# Altium project DIO_MCX_Isolated.PrjPCB (part 2 of 3)

## Sheet LVDS_IFC_MCX.SchDoc: DIO MCX 16 Isolated
size A3; EDA_Number: ARTIQ; Projet: ARTIQ/SINARA; Author: G.Kasprowicz; CompanyName: WUT ISE; DrawnBy: G.Kasprowicz; Organization: WUT ISE; Address1: PW ISE; Address2: Nowowiejska 15/19 00-665 Warsaw; Address3: gkasprow@gmail.com; DocumentNumber: 5; Revision: 2; SheetNumber: 5; SheetTotal: 7; ModifiedBy: -; CheckedDate: -; Title2: LVDS Interface; DivGrp: WUT ISE; Designer: G.Kasprowicz; ModifiedDate: -; ProjectName: Sensor Box
Used 2 times, as channels U_LVDS_IFCA, U_LVDS_IFCB. Parts and nets are listed once, with the designators drawn on the sheet.
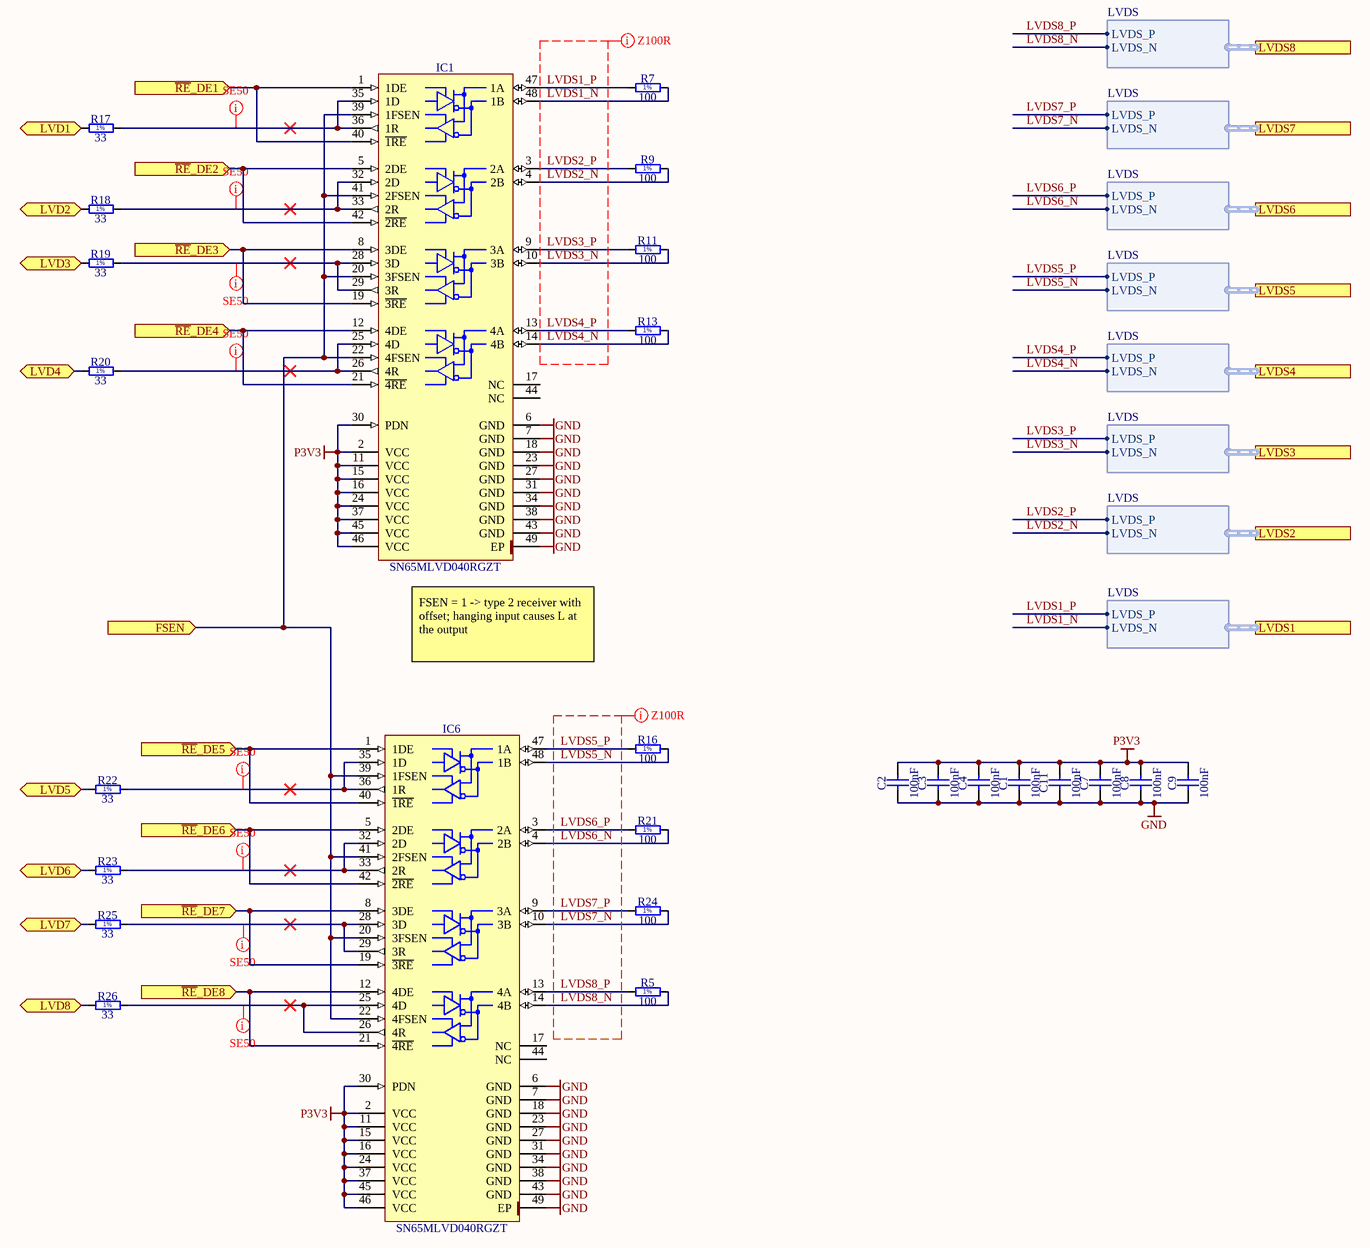
[diagram p2: LVDS_IFC_MCX.SchDoc]

### Parts
C1  100nF  [CAPC1005X55N]
C2  100nF  [CAPC1005X55N]
C3  100nF  [CAPC1005X55N]
C4  100nF  [CAPC1005X55N]
C7  100nF  [CAPC1005X55N]
C8  100nF  [CAPC1005X55N]
C9  100nF  [CAPC1005X55N]
C11  100nF  [CAPC1005X55N]
IC1  SN65MLVD040RGZT  [QFN50P700X700X100-49N-S420]
IC6  SN65MLVD040RGZT  [QFN50P700X700X100-49N-S420]
R5  100  [RESC1005X40N]
R7  100  [RESC1005X40N]
R9  100  [RESC1005X40N]
R11  100  [RESC1005X40N]
R13  100  [RESC1005X40N]
R16  100  [RESC1005X40N]
R17  33  [RESC1005X40N]
R18  33  [RESC1005X40N]
R19  33  [RESC1005X40N]
R20  33  [RESC1005X40N]
R21  100  [RESC1005X40N]
R22  33  [RESC1005X40N]
R23  33  [RESC1005X40N]
R24  100  [RESC1005X40N]
R25  33  [RESC1005X40N]
R26  33  [RESC1005X40N]

### Ports
FSEN (in), LVD1 (bidir), LVD2 (bidir), LVD3 (bidir), LVD4 (bidir), LVD5 (bidir), LVD6 (bidir), LVD7 (bidir), LVD8 (bidir), LVDS1 (harness LVDS), LVDS2 (harness LVDS), LVDS3 (harness LVDS), LVDS4 (harness LVDS), LVDS5 (harness LVDS), LVDS6 (harness LVDS), LVDS7 (harness LVDS), LVDS8 (harness LVDS), ~{RE}_DE1 (in), ~{RE}_DE2 (in), ~{RE}_DE3 (in), ~{RE}_DE4 (in), ~{RE}_DE5 (in), ~{RE}_DE6 (in), ~{RE}_DE7 (in), ~{RE}_DE8 (in)

### Harnesses
LVDS: LVDS_P, LVDS_N

### Nets
GND: C1.1 C2.1 C3.1 C4.1 C7.1 C8.1 C9.1 C11.1 IC1.6(GND) IC1.7(GND) IC1.18(GND) IC1.23(GND) IC1.27(GND) IC1.31(GND) IC1.34(GND) IC1.38(GND) IC1.43(GND) IC1.49(EP) IC6.6(GND) IC6.7(GND) IC6.18(GND) IC6.23(GND) IC6.27(GND) IC6.31(GND) IC6.34(GND) IC6.38(GND) IC6.43(GND) IC6.49(EP)
P3V3: C1.2 C2.2 C3.2 C4.2 C7.2 C8.2 C9.2 C11.2 IC1.2(VCC) IC1.11(VCC) IC1.15(VCC) IC1.16(VCC) IC1.24(VCC) IC1.30(PDN) IC1.37(VCC) IC1.45(VCC) IC1.46(VCC) IC6.2(VCC) IC6.11(VCC) IC6.15(VCC) IC6.16(VCC) IC6.24(VCC) IC6.30(PDN) IC6.37(VCC) IC6.45(VCC) IC6.46(VCC)
FSEN: IC1.20(3FSEN) IC1.22(4FSEN) IC1.39(1FSEN) IC1.41(2FSEN) IC6.20(3FSEN) IC6.22(4FSEN) IC6.39(1FSEN) IC6.41(2FSEN) ; port FSEN
LVD1: R17.1 ; port LVD1
LVD2: R18.1 ; port LVD2
LVD3: R19.1 ; port LVD3
LVD4: R20.1 ; port LVD4
LVD5: R22.1 ; port LVD5
LVD6: R23.1 ; port LVD6
LVD7: R25.1 ; port LVD7
LVD8: R26.1 ; port LVD8
LVDS1_N: IC1.48(1B) R7.2 ; port LVDS1.LVDS_N
LVDS1_P: IC1.47(1A) R7.1 ; port LVDS1.LVDS_P
LVDS2_N: IC1.4(2B) R9.2 ; port LVDS2.LVDS_N
LVDS2_P: IC1.3(2A) R9.1 ; port LVDS2.LVDS_P
LVDS3_N: IC1.10(3B) R11.2 ; port LVDS3.LVDS_N
LVDS3_P: IC1.9(3A) R11.1 ; port LVDS3.LVDS_P
LVDS4_N: IC1.14(4B) R13.2 ; port LVDS4.LVDS_N
LVDS4_P: IC1.13(4A) R13.1 ; port LVDS4.LVDS_P
LVDS5_N: IC6.48(1B) R16.2 ; port LVDS5.LVDS_N
LVDS5_P: IC6.47(1A) R16.1 ; port LVDS5.LVDS_P
LVDS6_N: IC6.4(2B) R21.2 ; port LVDS6.LVDS_N
LVDS6_P: IC6.3(2A) R21.1 ; port LVDS6.LVDS_P
LVDS7_N: IC6.10(3B) R24.2 ; port LVDS7.LVDS_N
LVDS7_P: IC6.9(3A) R24.1 ; port LVDS7.LVDS_P
LVDS8_N: IC6.14(4B) R5.2 ; port LVDS8.LVDS_N
LVDS8_P: IC6.13(4A) R5.1 ; port LVDS8.LVDS_P
~{RE}_DE1: IC1.1(1DE) IC1.40(~{1RE}) ; port ~{RE}_DE1
~{RE}_DE2: IC1.5(2DE) IC1.42(~{2RE}) ; port ~{RE}_DE2
~{RE}_DE3: IC1.8(3DE) IC1.19(~{3RE}) ; port ~{RE}_DE3
~{RE}_DE4: IC1.12(4DE) IC1.21(~{4RE}) ; port ~{RE}_DE4
~{RE}_DE5: IC6.1(1DE) IC6.40(~{1RE}) ; port ~{RE}_DE5
~{RE}_DE6: IC6.5(2DE) IC6.42(~{2RE}) ; port ~{RE}_DE6
~{RE}_DE7: IC6.8(3DE) IC6.19(~{3RE}) ; port ~{RE}_DE7
~{RE}_DE8: IC6.12(4DE) IC6.21(~{4RE}) ; port ~{RE}_DE8
NetIC1_25: IC1.25(4D) IC1.26(4R) R20.2
NetIC1_28: IC1.28(3D) IC1.29(3R) R19.2
NetIC1_32: IC1.32(2D) IC1.33(2R) R18.2
NetIC1_35: IC1.35(1D) IC1.36(1R) R17.2
NetIC6_25: IC6.25(4D) IC6.26(4R) R26.2
NetIC6_28: IC6.28(3D) IC6.29(3R) R25.2
NetIC6_32: IC6.32(2D) IC6.33(2R) R23.2
NetIC6_35: IC6.35(1D) IC6.36(1R) R22.2

Not connected (* = marked no-connect by the designer): IC1 17(NC) 44(NC); IC6 17(NC) 44(NC)

### Channels
U_LVDS_IFCA: designators end in A; ports FSEN=NetIC1A_20 LVD1=IO LVD2=IO LVD3=IO LVD4=IO LVD5=IO LVD6=IO LVD7=IO LVD8=IO ~{RE}_DE1=~{RE}_DE1A ~{RE}_DE2=~{RE}_DE2A ~{RE}_DE3=~{RE}_DE3A ~{RE}_DE4=~{RE}_DE4A ~{RE}_DE5=~{RE}_DE5A ~{RE}_DE6=~{RE}_DE6A ~{RE}_DE7=~{RE}_DE7A ~{RE}_DE8=~{RE}_DE8A
U_LVDS_IFCB: designators end in B; ports FSEN=NetIC1A_20 LVD1=IO1 LVD2=IO3 LVD3=IO5 LVD4=IO7 LVD5=IO15 LVD6=IO13 LVD7=IO11 LVD8=IO9 ~{RE}_DE1=~{RE}_DE1B ~{RE}_DE2=~{RE}_DE2B ~{RE}_DE3=~{RE}_DE3B ~{RE}_DE4=~{RE}_DE4B ~{RE}_DE5=~{RE}_DE5B ~{RE}_DE6=~{RE}_DE6B ~{RE}_DE7=~{RE}_DE7B ~{RE}_DE8=~{RE}_DE8B

### Layout directives
net class Z100R: LVDS1_N, LVDS1_P, LVDS2_N, LVDS2_P, LVDS3_N, LVDS3_P, LVDS4_N, LVDS4_P, LVDS5_N, LVDS5_P, LVDS6_N, LVDS6_P, LVDS7_N, LVDS7_P, LVDS8_N, LVDS8_P
net class SE50; rule Width Constraint [Pref Width = 0.35mm    Min Width = 0.3mm    Max Width = 0.35mm]: NetIC1A_25, NetIC1A_28, NetIC1A_32, NetIC1A_35, NetIC6A_25, NetIC6A_28, NetIC6A_32, NetIC6A_35

### Notes on the sheet
- (near IC1) FSEN = 1 -> type 2 receiver with offset; hanging input causes L at the output
- ARTIQ
- Project
- Name
- Copyright WUT ISE 2020.
  This document describes Open Hardware and is licensed under the CERN-OHL-S v2
  You may redistribute and modify this documentation and make products using it under the terms of the CERN-OHL-S v2 (https:/cern.ch/cern-ohl). This documentation is distributed WITHOUT ANY EXPRESS OR IMPLIED WARRANTY, INCLUDING OF MERCHANTABILITY, SATISFACTORY QUALITY AND FITNESS FOR A PARTICULAR PURPOSE. Please see the CERN-OHL-S v2 for applicable conditions.
  As per CERN-OHL-S v2 section 4, should You produce hardware based on these sources, You must maintain the Source Location visible on the silkscreen or top copper for a DI/OT System Board PCB or other product you make using this documentation.
- Sheet
- 2020
- Size
- A3
- of
- Rev
- -------------------------------
- 1.0
- (in symbol R0402_33R_1%_0.0625W_100PPM) 1%
- (in symbol R0402_100R_1%_0.1W_100PPM) 1%

### Library data of the parts
C1-C4 C7-C9 C11 = CC0402_100NF_16V_10%_X5R: Non-polarised capacitor; Part Description: SMD Multilayer Chip Ceramic Capacitor; Manufacturer: GENERIC; Manufacturer1 Part Number: GRM155R61C104KA88D; Voltage: 16V; TC: X5R; Tolerance: ±10%; Part Number: CC0402_100NF_16V_10%_X5R; Component Kind: Standard; Component Type: Standard; Pin Count: 2; Value: 100nF; Status: None; Manufacturer Part Number: CC0402_100NF_16V_10%_X5R; Case: 0402; Mounted: Yes; Socket: No; SMD: Yes; Sense: No; Manufacturer1 Example: MURATA; Manufacturer1 ComponentHeight: 0.55mm; HelpURL: \\cern.ch\dfs\Applications\Altium\Datasheets\CC0402_X5R_MURATA_GRM.pdf; Author: CERN DEM JLC; CreateDate: 10.12.2013; LatestRevisionDate: 10.12.2013
IC1 IC6 = SN65MLVD040RGZT: 4-Channel Half-Duplex M-LVDS Line Transceiver; Manufacturer: TEXAS INSTRUMENTS; PressFit: No; Bonding: No; Part Number: SN65MLVD040RGZT; Component Kind: Standard; Component Type: Standard; Device: SN65MLVD040RGZT; PackageDescription: QFN, 0.50mm Pitch, Square; 48 Pin, 7.00mm L X 7.00mm W X 1mm H body (W/Thermal Tab 4.2mm X 4.2mm), IPC Medium Density; Part Description: 4-Channel Half-Duplex M-LVDS Line Transceiver; Manufacturer Part Number: SN65MLVD040RGZT; Pin Count: 49; Case: QFN48; Mounted: Yes; Socket: No; SMD: Yes; Sense: No; ComponentHeight: 1mm; Author: CERN DEM JLC; HelpURL: \\cern.ch\dfs\Applications\Altium\Datasheets\SN65MLVD040RGZT.pdf; CreateDate: 17.03.2011; LatestRevisionDate: 17.03.2011
R5 R7 R9 R11 R13 R16 R21 R24 = R0402_100R_1%_0.1W_100PPM: Resistor - 1%; Part Description: General Purpose Thick Film Chip Resistor; Manufacturer: GENERIC; Manufacturer Part Number: R0402_100R_1%_0.1W_100PPM_50V; Manufacturer1 Part Number: ERJ2RKF1000X; Power: 0.1W; TC: ±100ppm/°C; Voltage: 50V; Part Number: R0402_100R_1%_0.1W_100PPM; Component Kind: Standard; Component Type: Standard; Pin Count: 2; Value: 100; Status: Not recommended; Tolerance: ±1%; Case: 0402; Mounted: Yes; Sense: No; Socket: No; SMD: Yes; Manufacturer1 Example: PANASONIC; Manufacturer1 ComponentHeight: 0.4mm; HelpURL: \\cern.ch\dfs\Applications\Altium\Datasheets\R0402_PANASONIC_ERJ2RK.pdf; Author: CERN DEM JLC; CreateDate: 12.12.2013; LatestRevisionDate: 03.03.2015
R17-R20 R22 R23 R25 R26 = R0402_33R_1%_0.0625W_100PPM: Resistor - 1%; Part Description: General Purpose Thick Film Chip Resistor; Manufacturer: GENERIC; Manufacturer1 Part Number: 232270673309L; TC: ±100ppm/°C; PressFit: No; Part Number: R0402_33R_1%_0.0625W_100PPM; Component Kind: Standard; Component Type: Standard; Pin Count: 2; Value: 33; Status: Not Recommended; Power: 0.0625W; Tolerance: ±1%; Manufacturer Part Number: R0402_33R_1%_0.0625W_100PPM; Case: 0402; Mounted: Yes; Sense: No; Socket: No; SMD: Yes; Manufacturer1 Example: YAGEO PHYCOMP; Manufacturer1 ComponentHeight: 0.4mm; HelpURL: \\cern.ch\dfs\Applications\Altium\Datasheets\R0402_Phycomp_RC0402.pdf; Author: CERN DEM JLC; CreateDate: 03.12.2007; LatestRevisionDate: 17.10.2012

## Sheet ID_logic.SchDoc: DIO MCX 16 Isolated
size A4; DocumentNumber: 4; SheetNumber: 4; SheetTotal: 7; ModifiedBy: -; CreateDate: XX/XX/XXXX; CheckedDate: -; Title2: Title2; DivGrp: CTI
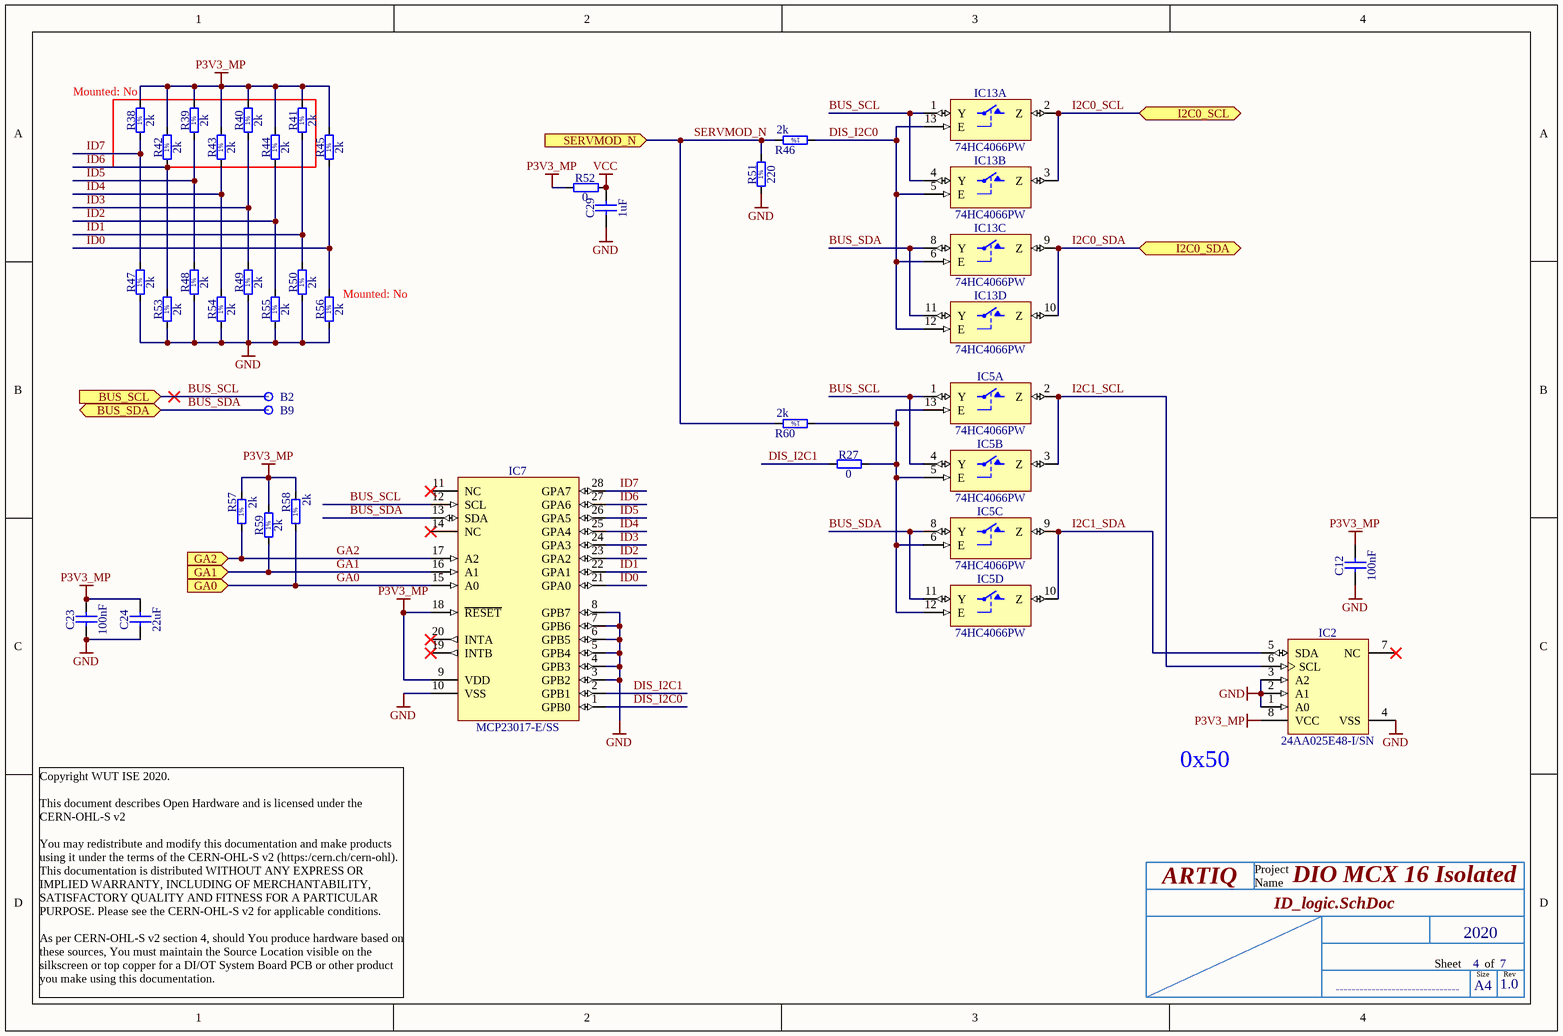
[diagram p3: ID_logic.SchDoc]

### Parts
B2  Plated Hole  [c130h60]  (value not drawn)
B9  Plated Hole  [c130h60]  (value not drawn)
C12  100nF  [CAPC1005X55N]
C23  100nF  [CAPC1005X55N]
C24  22uF  [CAPC1709X100N]
C29  1uF  [CAPC2012X140N]
IC2  24AA025E48-I/SN  [SOIC127P600X175-8N]
IC5  74HC4066PW  [SOP65P640X110-14N]  (parts A,B,C,D of 4)
IC7  MCP23017-E/SS  [SOP65P780X200-28N]
IC13  74HC4066PW  [SOP65P640X110-14N]  (parts A,B,C,D of 4)
R27  0  [RESC1005X40N]
R38  2k  Mounted: No  [RESC1608X55N]
R39  2k  [RESC1608X55N]
R40  2k  [RESC1608X55N]
R41  2k  [RESC1608X55N]
R42  2k  [RESC1608X55N]
R43  2k  [RESC1608X55N]
R44  2k  [RESC1608X55N]
R45  2k  [RESC1608X55N]
R46  2k  [RESC1608X55N]
R47  2k  [RESC1608X55N]
R48  2k  [RESC1608X55N]
R49  2k  [RESC1608X55N]
R50  2k  [RESC1608X55N]
R51  220  [RESC1608X55N]
R52  0  [RESC1005X40N]
R53  2k  [RESC1608X55N]
R54  2k  [RESC1608X55N]
R55  2k  [RESC1608X55N]
R56  2k  Mounted: No  [RESC1608X55N]
R57  2k  [RESC1608X55N]
R58  2k  [RESC1608X55N]
R59  2k  [RESC1608X55N]
R60  2k  [RESC1608X55N]

### Ports
BUS_SCL (in), BUS_SDA (bidir), GA0 (in), GA1 (in), GA2 (in), I2C0_SCL (bidir), I2C0_SDA (bidir), SERVMOD_N (in)

### Nets
GND: C12.1 C23.1 C24.1 C29.1 IC2.1(A0) IC2.2(A1) IC2.3(A2) IC2.4(VSS) IC5.7(GND) IC7.3(GPB2) IC7.4(GPB3) IC7.5(GPB4) IC7.6(GPB5) IC7.7(GPB6) IC7.8(GPB7) IC7.10(VSS) IC13.7(GND) R47.1 R48.1 R49.1 R50.1 R51.1 R53.1 R54.1 R55.1 R56.1
P3V3_MP: C12.2 C23.2 C24.2 IC2.8(VCC) IC7.9(VDD) IC7.18(~{RESET}) R38.2 R39.2 R40.2 R41.2 R42.2 R43.2 R44.2 R45.2 R52.1 R57.2 R58.2 R59.2
VCC: C29.2 IC5.14(VCC) IC13.14(VCC) R52.2
BUS_SCL: B2.1 IC5.1(Y) IC5.4(Y) IC7.12(SCL) IC13.1(Y) IC13.4(Y) ; port BUS_SCL
BUS_SDA: B9.1 IC5.8(Y) IC5.11(Y) IC7.13(SDA) IC13.8(Y) IC13.11(Y) ; port BUS_SDA
DIS_I2C0: IC7.1(GPB0) IC13.5(E) IC13.6(E) IC13.12(E) IC13.13(E) R46.1
DIS_I2C1: IC7.2(GPB1) R27.1
GA0: IC7.15(A0) R58.1 ; port GA0
GA1: IC7.16(A1) R59.1 ; port GA1
GA2: IC7.17(A2) R57.1 ; port GA2
I2C0_SCL: IC13.2(Z) IC13.3(Z) ; port I2C0_SCL
I2C0_SDA: IC13.9(Z) IC13.10(Z) ; port I2C0_SDA
I2C1_SCL: IC2.6(SCL) IC5.2(Z) IC5.3(Z)
I2C1_SDA: IC2.5(SDA) IC5.9(Z) IC5.10(Z)
ID0: IC7.21(GPA0) R45.1 R56.2
ID1: IC7.22(GPA1) R41.1 R50.2
ID2: IC7.23(GPA2) R44.1 R55.2
ID3: IC7.24(GPA3) R40.1 R49.2
ID4: IC7.25(GPA4) R43.1 R54.2
ID5: IC7.26(GPA5) R39.1 R48.2
ID6: IC7.27(GPA6) R42.1 R53.2
ID7: IC7.28(GPA7) R38.1 R47.2
SERVMOD_N: R46.2 R51.2 R60.2 ; port SERVMOD_N
NetIC5_5: IC5.5(E) IC5.6(E) IC5.12(E) IC5.13(E) R27.2 R60.1

Not connected (* = marked no-connect by the designer): IC2 7(NC)*; IC7 11(NC)* 14(NC)* 19(INTB)* 20(INTA)*

### Notes on the sheet
- 0x50
- ARTIQ
- Project
- Name
- Sheet
- 2020
- Size
- A4
- of
- 1.0
- Rev
- Copyright WUT ISE 2020.
  This document describes Open Hardware and is licensed under the CERN-OHL-S v2
  You may redistribute and modify this documentation and make products using it under the terms of the CERN-OHL-S v2 (https:/cern.ch/cern-ohl). This documentation is distributed WITHOUT ANY EXPRESS OR IMPLIED WARRANTY, INCLUDING OF MERCHANTABILITY, SATISFACTORY QUALITY AND FITNESS FOR A PARTICULAR PURPOSE. Please see the CERN-OHL-S v2 for applicable conditions.
  As per CERN-OHL-S v2 section 4, should You produce hardware based on these sources, You must maintain the Source Location visible on the silkscreen or top copper for a DI/OT System Board PCB or other product you make using this documentation.
- -------------------------------
- (in symbol R0603_2K_1%_0.1W_100PPM) 1%
- (in symbol R0603_220R_1%_0.1W_100PPM) 1%

### Library data of the parts
B2 B9 = PLATED_HOLE0.6_PAD1.3: Single Terminal Socket; Part Description: Plated Through Hole: Hole Dia.=0.6mm Pad Dia.=1.3mm; Mounted: No; Part Number: PLATED_HOLE0.6_PAD1.3; Component Kind: Standard (No BOM); Component Type: Standard (No BOM); Pin Count: 1; Family: Plated Hole; Socket: No; SMD: No; Sense: No; Status: None; ComponentHeight: 0mm; HelpURL: Undefined; Author: CERN DEM MR; CreateDate: 02.03.2016; LatestRevisionDate: 02.03.2016; PackageDescription: Plated Through Hole: Hole Dia.=0.6mm Pad Dia.=1.3mm
C12 C23 = CC0402_100NF_16V_10%_X5R: as C1 on sheet LVDS_IFC_MCX; Part Number: CC0402_100NF_16V_10%_X5R; Component Kind: Standard; Component Type: Standard; Pin Count: 2; Value: 100nF; Status: None; Manufacturer Part Number: CC0402_100NF_16V_10%_X5R; Case: 0402; Mounted: Yes; Socket: No; SMD: Yes; Sense: No; Manufacturer1 Example: MURATA; Manufacturer1 ComponentHeight: 0.55mm; HelpURL: \\cern.ch\dfs\Applications\Altium\Datasheets\CC0402_X5R_MURATA_GRM.pdf; Author: CERN DEM JLC; CreateDate: 10.12.2013; LatestRevisionDate: 10.12.2013
C24 = CC0603_22UF_6.3V_20%_X5R: Non-polarised capacitor; Part Description: SMD Multilayer Chip Ceramic Capacitor; Manufacturer: GENERIC; Manufacturer1 Part Number: C1608X5R0J226M080; Voltage: 6.3V; TC: X5R; Tolerance: ±20%; Part Number: CC0603_22UF_6.3V_20%_X5R; Component Kind: Standard; Component Type: Standard; Pin Count: 2; Value: 22uF; Status: None; Manufacturer Part Number: CC0603_22UF_6.3V_20%_X5R; Case: 0603; Mounted: Yes; Socket: No; SMD: Yes; Sense: No; Manufacturer1 Example: TDK; Manufacturer1 ComponentHeight: 1mm; HelpURL: \\cern.ch\dfs\Applications\Altium\Datasheets\CC0603_X5R_TDK_C.pdf; Author: CERN DEM JLC; CreateDate: 16.12.2013; LatestRevisionDate: 13.09.2016
C29 = CC0805_1UF_35V_20%_X7R: Non-polarised capacitor; Part Description: SMD Multilayer Chip Ceramic Capacitor; Manufacturer: GENERIC; Manufacturer1 Part Number: GMK212B7105MG-T; Voltage: 35V; TC: X7R; Tolerance: ±20%; Part Number: CC0805_1UF_35V_20%_X7R; Component Kind: Standard; Component Type: Standard; Pin Count: 2; Value: 1uF; Status: Not Recommended; Manufacturer Part Number: CC0805_1UF_35V_20%_X7R; Case: 0805; Mounted: Yes; Socket: No; SMD: Yes; Sense: No; Manufacturer1 Example: TAIYO YUDEN; Manufacturer1 ComponentHeight: 1.35mm; HelpURL: \\cern.ch\dfs\Applications\Altium\Datasheets\CC0805_X7R_TAIYO-YUDEN_HIGH-VALUE.pdf; Author: CERN DEM JLC; CreateDate: 22.06.2011; LatestRevisionDate: 22.06.2011
IC2 = 24AA025E48-I/SN: 1.7V-5.5V, 2K I2C™ Serial EEPROMs with EUI-48™ Node Identity; Manufacturer: MICROCHIP TECHNOLOGY; PressFit: No; Bonding: No; Part Number: 24AA025E48-I/SN; Component Kind: Standard; Component Type: Standard; Device: 24AA025E48-I/SN; PackageDescription: SOIC 8, Pitch 1.27mm - Body 4x5mm, IPC Medium Density; Part Description: 1.7V-5.5V, 2K I2C™ Serial EEPROMs with EUI-48™ Node Identity; Manufacturer Part Number: 24AA025E48-I/SN; Pin Count: 8; Case: SOIC8; Mounted: Yes; Socket: No; SMD: Yes; Sense: No; ComponentHeight: 1.75mm; HelpURL: \\cern.ch\dfs\Applications\Altium\Datasheets\24AA025E48-I-SN.pdf; Author: CERN DEM MR; CreateDate: 19.07.2016; LatestRevisionDate: 19.07.2016
IC5 IC13 = 74HC4066PW: Part Description: Quad Single-Pole Single-Throw Analog Switch; Manufacturer: NXP SEMICONDUCTORS; PressFit: No; Bonding: No; Part Number: 74HC4066PW; Component Kind: Standard; Component Type: Standard; Device: 74HC4066PW; PackageDescription: SOP, 14-Leads, Body 4.4x5mm (max), Pitch 0.65mm, IPC Medium Density; Manufacturer Part Number: 74HC4066PW; Pin Count: 14; Case: TSSOP14; Mounted: Yes; Socket: No; SMD: Yes; Sense: No; ComponentHeight: 1.1mm; Author: CERN DEM JLC; HelpURL: \\cern.ch\dfs\Applications\Altium\Datasheets\74HC4066PW.pdf; CreateDate: 19.11.2014; LatestRevisionDate: 19.11.2014
IC7 = MCP23017-E/SS: 16-bit I/O Port Expander With Serial Interface; Manufacturer: MICROCHIP TECHNOLOGY; PressFit: No; Bonding: No; Part Number: MCP23017-E/SS; Component Kind: Standard; Component Type: Standard; Device: MCP23017-E/SS; PackageDescription: SOP, 0.65mm Pitch; 28 pin, 5.30mm W X 10.20mm L X 2.00mm H body, IPC Medium Density; Part Description: 16-bit I/O Port Expander With Serial Interface; Manufacturer Part Number: MCP23017-E/SS; Pin Count: 28; Case: SSOP28; Mounted: Yes; Socket: No; SMD: Yes; Sense: No; ComponentHeight: 2mm; Author: CERN DEM JLC; HelpURL: \\cern.ch\dfs\Applications\Altium\Datasheets\MCP23017-E-SS.pdf; CreateDate: 17/01/2011; LatestRevisionDate: 17/01/2011
R27 R52 = R0402_0R_JUMPER: Resistor; Part Description: 1A (0.05R Max DC Resistance) Zero Ohm Jumper; Manufacturer: GENERIC; Manufacturer1 Part Number: 232270591001L; PressFit: No; Part Number: R0402_0R_JUMPER; Component Kind: Standard; Component Type: Standard; Pin Count: 2; Value: 0; Status: Not Recommended; Manufacturer Part Number: R0402_0R_JUMPER; Case: 0402; Mounted: Yes; Sense: No; Socket: No; SMD: Yes; Manufacturer1 Example: YAGEO PHYCOMP; Manufacturer1 ComponentHeight: 0.4mm; HelpURL: \\cern.ch\dfs\Applications\Altium\Datasheets\R0402_Phycomp_RC0402.pdf; Author: CERN DEM JLC; CreateDate: 03.12.2007; LatestRevisionDate: 17.10.2012
R38 R45-R50 R53-R60 = R0603_2K_1%_0.1W_100PPM: Resistor - 1%; Part Description: General Purpose Thick Film Chip Resistor; Manufacturer: GENERIC; Manufacturer1 Part Number: NRC06F2001TRF; Power: 0.1W; TC: ±100ppm/°C; PressFit: No; Part Number: R0603_2K_1%_0.1W_100PPM; Component Kind: Standard; Component Type: Standard; Pin Count: 2; Value: 2k; Status: Preferred; Tolerance: ±1%; Manufacturer Part Number: R0603_2K_1%_0.1W_100PPM; Case: 0603; Sense: No; Socket: No; SMD: Yes; Manufacturer1 Example: NIC COMPONENT; Manufacturer1 ComponentHeight: 0.55mm; HelpURL: \\cern.ch\dfs\Applications\Altium\Datasheets\R0603_NIC_NRC.pdf; Author: CERN DEM JLC; CreateDate: 03/12/2007; LatestRevisionDate: 13/03/2008
  R38 R56: ClassName: NotMounted
  R45-R50 R53-R55 R57-R60: Mounted: Yes
R39-R44 = R0603_2K_1%_0.1W_100PPM: Resistor - 1%; Part Description: General Purpose Thick Film Chip Resistor; Manufacturer: GENERIC; Manufacturer1 Part Number: NRC06F2001TRF; Power: 0.1W; TC: ±100ppm/°C; PressFit: No; Mounted: No; Part Number: R0603_2K_1%_0.1W_100PPM; Component Kind: Standard; Component Type: Standard; Pin Count: 2; Value: 2k; Status: Preferred; Tolerance: ±1%; Manufacturer Part Number: R0603_2K_1%_0.1W_100PPM; Case: 0603; Sense: No; Socket: No; SMD: Yes; Manufacturer1 Example: NIC COMPONENT; Manufacturer1 ComponentHeight: 0.55mm; HelpURL: \\cern.ch\dfs\Applications\Altium\Datasheets\R0603_NIC_NRC.pdf; Author: CERN DEM JLC; CreateDate: 03/12/2007; LatestRevisionDate: 13/03/2008; ClassName: NotMounted
R51 = R0603_220R_1%_0.1W_100PPM: Resistor - 1%; Part Description: General Purpose Thick Film Chip Resistor; Manufacturer: GENERIC; Manufacturer1 Part Number: NRC06F2200TRF; Power: 0.1W; TC: ±100ppm/°C; PressFit: No; Part Number: R0603_220R_1%_0.1W_100PPM; Component Kind: Standard; Component Type: Standard; Pin Count: 2; Value: 220; Status: Preferred; Tolerance: ±1%; Manufacturer Part Number: R0603_220R_1%_0.1W_100PPM; Case: 0603; Mounted: Yes; Sense: No; Socket: No; SMD: Yes; Manufacturer1 Example: NIC COMPONENT; Manufacturer1 ComponentHeight: 0.55mm; HelpURL: \\cern.ch\dfs\Applications\Altium\Datasheets\R0603_NIC_NRC.pdf; Author: CERN DEM JLC; CreateDate: 03.12.2007; LatestRevisionDate: 13.03.2008

## Sheet P1.SchDoc: DIO MCX 16 Isolated
size A4; DocumentNumber: 6; SheetNumber: 6; SheetTotal: 7; ModifiedBy: -; CreateDate: XX/XX/XXXX; CheckedDate: -; Title2: Title2; DivGrp: CTI
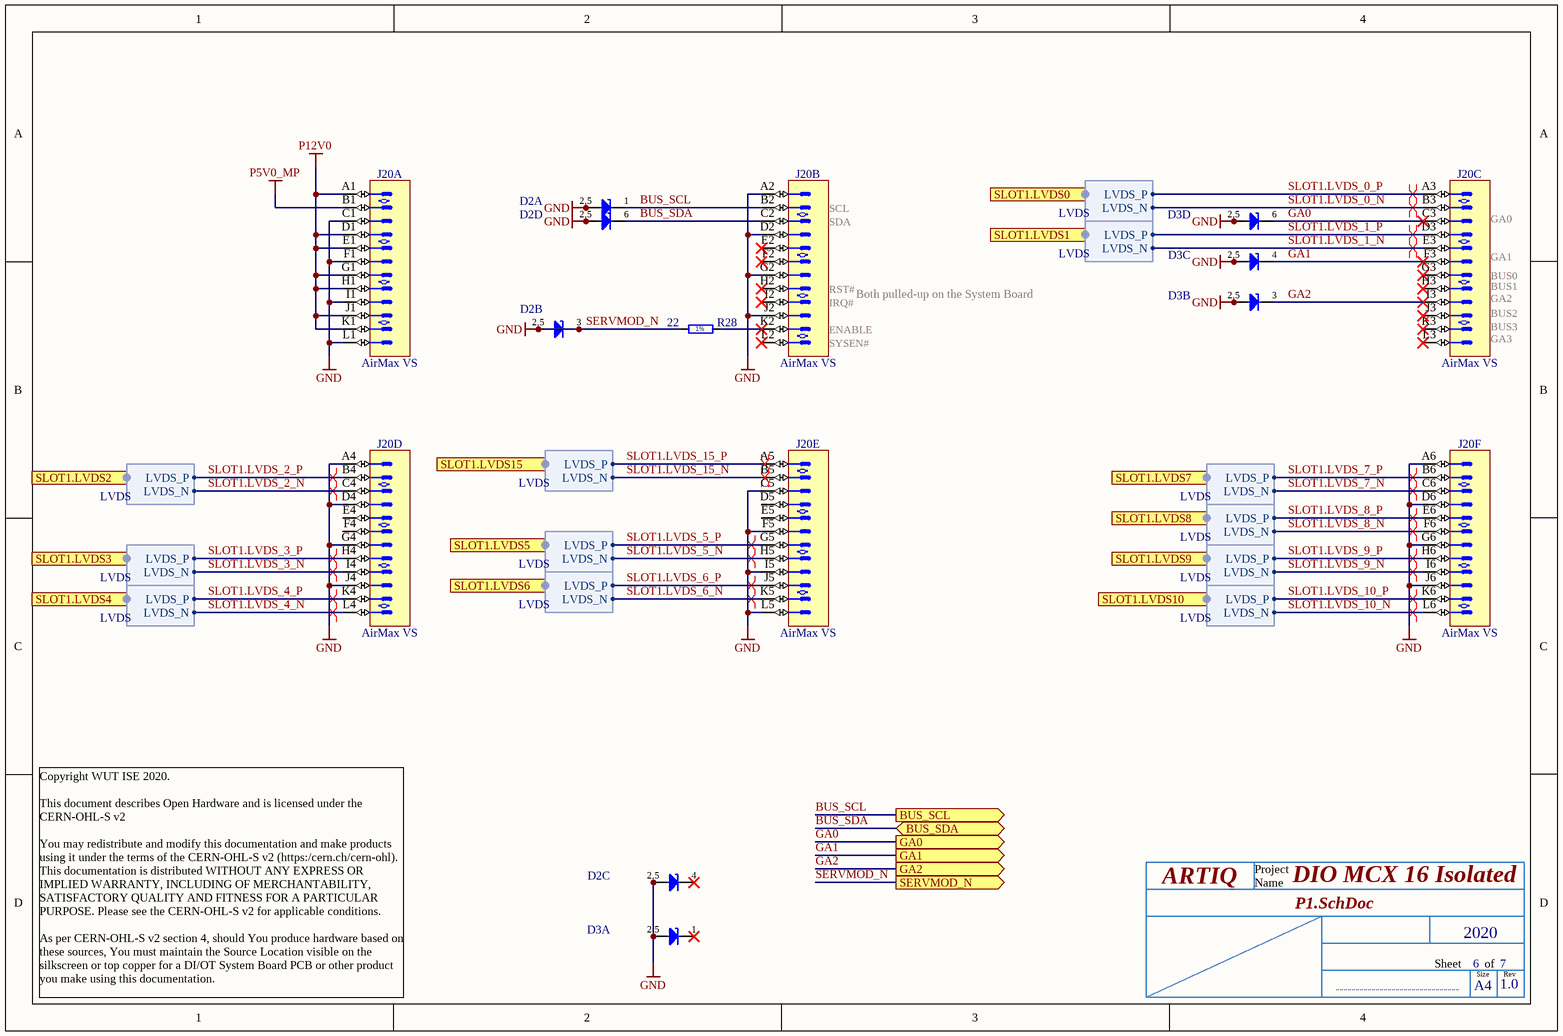
[diagram p4: P1.SchDoc]

### Parts
D2  PESD3V3S4UD  [SOT95P280X110-6N]  (value not drawn)  (parts A,B,C,D of 4)
D3  PESD3V3S4UD  [SOT95P280X110-6N]  (value not drawn)  (parts A,B,C,D of 4)
J20  AirMax VS  [AMPHENOL_10052825-101LF]  (parts A,B,C,D,E,F of 6)
R28  22  [RESC1005X40N]

### Ports
BUS_SCL (out), BUS_SDA (bidir), GA0 (out), GA1 (out), GA2 (out), SERVMOD_N (out), SLOT1.LVDS0 (harness LVDS), SLOT1.LVDS1 (harness LVDS), SLOT1.LVDS2 (harness LVDS), SLOT1.LVDS3 (harness LVDS), SLOT1.LVDS4 (harness LVDS), SLOT1.LVDS5 (harness LVDS), SLOT1.LVDS6 (harness LVDS), SLOT1.LVDS7 (harness LVDS), SLOT1.LVDS8 (harness LVDS), SLOT1.LVDS9 (harness LVDS), SLOT1.LVDS10 (harness LVDS), SLOT1.LVDS15 (harness LVDS)

### Harnesses
LVDS: LVDS_P, LVDS_N

### Nets
GND: D2.2(A) D2.5(A) D3.2(A) D3.5(A) J20.A2 J20.A4 J20.A6 J20.C1 J20.C5 J20.D2 J20.D4 J20.D6 J20.F1 J20.F5 J20.G2 J20.G4 J20.G6 J20.I1 J20.I5 J20.J2 J20.J4 J20.J6 J20.L1 J20.L5
P5V0_MP: J20.B1
P12V0: J20.A1 J20.D1 J20.E1 J20.G1 J20.H1 J20.J1 J20.K1
BUS_SCL: D2.1(C) J20.B2 ; port BUS_SCL
BUS_SDA: D2.6(C) J20.C2 ; port BUS_SDA
GA0: D3.6(C) J20.C3 ; port GA0
GA1: D3.4(C) J20.F3 ; port GA1
GA2: D3.3(C) J20.I3 ; port GA2
SERVMOD_N: D2.3(C) R28.1 ; port SERVMOD_N
SLOT1.LVDS_0_N: J20.B3 ; port SLOT1.LVDS0.LVDS_N  [project net LVDS4_N]
SLOT1.LVDS_0_P: J20.A3 ; port SLOT1.LVDS0.LVDS_P  [project net LVDS4_P]
SLOT1.LVDS_1_N: J20.E3 ; port SLOT1.LVDS1.LVDS_N  [project net LVDS5_N]
SLOT1.LVDS_1_P: J20.D3 ; port SLOT1.LVDS1.LVDS_P  [project net LVDS5_P]
SLOT1.LVDS_2_N: J20.C4 ; port SLOT1.LVDS2.LVDS_N  [project net LVDS8_N]
SLOT1.LVDS_2_P: J20.B4 ; port SLOT1.LVDS2.LVDS_P  [project net LVDS8_P]
SLOT1.LVDS_3_N: J20.I4 ; port SLOT1.LVDS3.LVDS_N  [project net LVDS3_N]
SLOT1.LVDS_3_P: J20.H4 ; port SLOT1.LVDS3.LVDS_P  [project net LVDS3_P]
SLOT1.LVDS_4_N: J20.L4 ; port SLOT1.LVDS4.LVDS_N  [project net LVDS6_N]
SLOT1.LVDS_4_P: J20.K4 ; port SLOT1.LVDS4.LVDS_P  [project net LVDS6_P]
SLOT1.LVDS_5_N: J20.H5 ; port SLOT1.LVDS5.LVDS_N  [project net LVDS2_N]
SLOT1.LVDS_5_P: J20.G5 ; port SLOT1.LVDS5.LVDS_P  [project net LVDS2_P]
SLOT1.LVDS_6_N: J20.K5 ; port SLOT1.LVDS6.LVDS_N  [project net LVDS7_N]
SLOT1.LVDS_6_P: J20.J5 ; port SLOT1.LVDS6.LVDS_P  [project net LVDS7_P]
SLOT1.LVDS_7_N: J20.C6 ; port SLOT1.LVDS7.LVDS_N  [project net LVDS6_N]
SLOT1.LVDS_7_P: J20.B6 ; port SLOT1.LVDS7.LVDS_P  [project net LVDS6_P]
SLOT1.LVDS_8_N: J20.F6 ; port SLOT1.LVDS8.LVDS_N  [project net LVDS7_N]
SLOT1.LVDS_8_P: J20.E6 ; port SLOT1.LVDS8.LVDS_P  [project net LVDS7_P]
SLOT1.LVDS_9_N: J20.I6 ; port SLOT1.LVDS9.LVDS_N  [project net LVDS8_N]
SLOT1.LVDS_9_P: J20.H6 ; port SLOT1.LVDS9.LVDS_P  [project net LVDS8_P]
SLOT1.LVDS_10_N: J20.L6 ; port SLOT1.LVDS10.LVDS_N  [project net LVDS1_N]
SLOT1.LVDS_10_P: J20.K6 ; port SLOT1.LVDS10.LVDS_P  [project net LVDS1_P]
SLOT1.LVDS_15_N: J20.B5 ; port SLOT1.LVDS15.LVDS_N  [project net LVDS5_N]
SLOT1.LVDS_15_P: J20.A5 ; port SLOT1.LVDS15.LVDS_P  [project net LVDS5_P]
NetJ20_K2: J20.K2 R28.2

Not connected (* = marked no-connect by the designer): D2 4(C)*; D3 1(C)*; J20 D5 E2* E4 E5 F2* F4 G3* H2* H3* I2* J3* K3* L2* L3*

### Layout directives
differential pair: LVDS1_N, LVDS1_P, LVDS2_N, LVDS2_P, LVDS3_N, LVDS3_P, LVDS4_N, LVDS4_P, LVDS5_N, LVDS5_P, LVDS6_N, LVDS6_P, LVDS7_N, LVDS7_P, LVDS8_N, LVDS8_P

### Notes on the sheet
- (near J20) SCL
- (near J20) SDA
- (near J20) GA0
- (near J20) RST#
- (near J20) IRQ#
- Both pulled-up on the System Board
- (near J20) BUS0
- (near J20) BUS1
- (near J20) BUS2
- (near J20) GA1
- (near J20) GA2
- (near J20) ENABLE
- (near J20) SYSEN#
- (near J20) BUS3
- (near J20) GA3
- ARTIQ
- Project
- Name
- Sheet
- 2020
- Size
- A4
- of
- 1.0
- Rev
- Copyright WUT ISE 2020.
  This document describes Open Hardware and is licensed under the CERN-OHL-S v2
  You may redistribute and modify this documentation and make products using it under the terms of the CERN-OHL-S v2 (https:/cern.ch/cern-ohl). This documentation is distributed WITHOUT ANY EXPRESS OR IMPLIED WARRANTY, INCLUDING OF MERCHANTABILITY, SATISFACTORY QUALITY AND FITNESS FOR A PARTICULAR PURPOSE. Please see the CERN-OHL-S v2 for applicable conditions.
  As per CERN-OHL-S v2 section 4, should You produce hardware based on these sources, You must maintain the Source Location visible on the silkscreen or top copper for a DI/OT System Board PCB or other product you make using this documentation.
- -------------------------------
- (in symbol PESD3V3S4UD, part A) 2,5
- (in symbol PESD3V3S4UD, part B) 2,5
- (in symbol PESD3V3S4UD, part C) 2,5
- (in symbol PESD3V3S4UD, part D) 2,5
- (in symbol R0402_22R_1%_0.0625W_100PPM) 1%

### Library data of the parts
D2 D3 = PESD3V3S4UD: Quad Common Anode ESD Protection Diodes (30kV); Manufacturer: NXP SEMICONDUCTORS; Voltage: 3V3; Power: 200W; PressFit: No; Bonding: No; Part Number: PESD3V3S4UD; Component Kind: Standard; Component Type: Standard; Device: PESD3V3S4UD; PackageDescription: SOT, 0.95mm Pitch; 6 Pin, 1.60mm W X 2.90mm L X 1.10mm H Body, IPC Medium Density; Part Description: Quad Common Anode ESD Protection Diodes (30kV); Manufacturer Part Number: PESD3V3S4UD; Pin Count: 6; Case: SOT23-6; Mounted: Yes; Socket: No; SMD: Yes; Sense: No; ComponentHeight: 1.1mm; HelpURL: \\cern.ch\dfs\Applications\Altium\Datasheets\PESD3V3S4UD.pdf; Author: CERN DEM MR; CreateDate: 08/02/2016; LatestRevisionDate: 16/01/2018
J20 = AMPHENOL_10052825-101LF: 72 Contacts Header, 6 Columns, 4 Pairs per Column; Part Description: 72 Contacts, 2mm Pitch, 6 Columns, 4 Pairs per Column, 4 Walls, Right Angle Header; Part Number: AMPHENOL_10052825-101LF; Component Kind: Standard; Component Type: Standard; Pin Count: 72; Family: AirMax VS; Mounted: Yes; Socket: No; SMD: No; PressFit: Yes; Sense: No; Status: None; Manufacturer: AMPHENOL; Manufacturer Part Number: 10052825-101LF; ComponentHeight: 15.35mm; HelpURL: \\cern.ch\dfs\Applications\Altium\Datasheets\AMPHENOL_10052825-101LF.pdf; ComponentLink1URL: \\cern.ch\dfs\Applications\Altium\Datasheets\AMPHENOL_10052825-101LF_Application.pdf; ComponentLink1Description: Application; Author: CERN DEM MR; CreateDate: 19/02/2018; LatestRevisionDate: 19/02/2018
R28 = R0402_22R_1%_0.0625W_100PPM: Resistor - 1%; Part Description: General Purpose Thick Film Chip Resistor; Manufacturer: GENERIC; Manufacturer1 Part Number: 232270672209L; TC: ±100ppm/°C; PressFit: No; Part Number: R0402_22R_1%_0.0625W_100PPM; Component Kind: Standard; Component Type: Standard; Pin Count: 2; Value: 22; Status: Not Recommended; Power: 0.0625W; Tolerance: ±1%; Manufacturer Part Number: R0402_22R_1%_0.0625W_100PPM; Case: 0402; Mounted: Yes; Socket: No; SMD: Yes; Manufacturer1 Example: YAGEO PHYCOMP; Manufacturer1 ComponentHeight: 0.4mm; HelpURL: \\cern.ch\dfs\Applications\Altium\Datasheets\R0402_Phycomp_RC0402.pdf; Author: CERN DEM JLC; CreateDate: 03.12.2007; LatestRevisionDate: 17.10.2012; Sense: No

## Sheet P6.SchDoc: DIO MCX 16 Isolated
size A4; DocumentNumber: 7; SheetNumber: 7; SheetTotal: 7; ModifiedBy: -; CreateDate: XX/XX/XXXX; CheckedDate: -; Title2: Title2; DivGrp: CTI
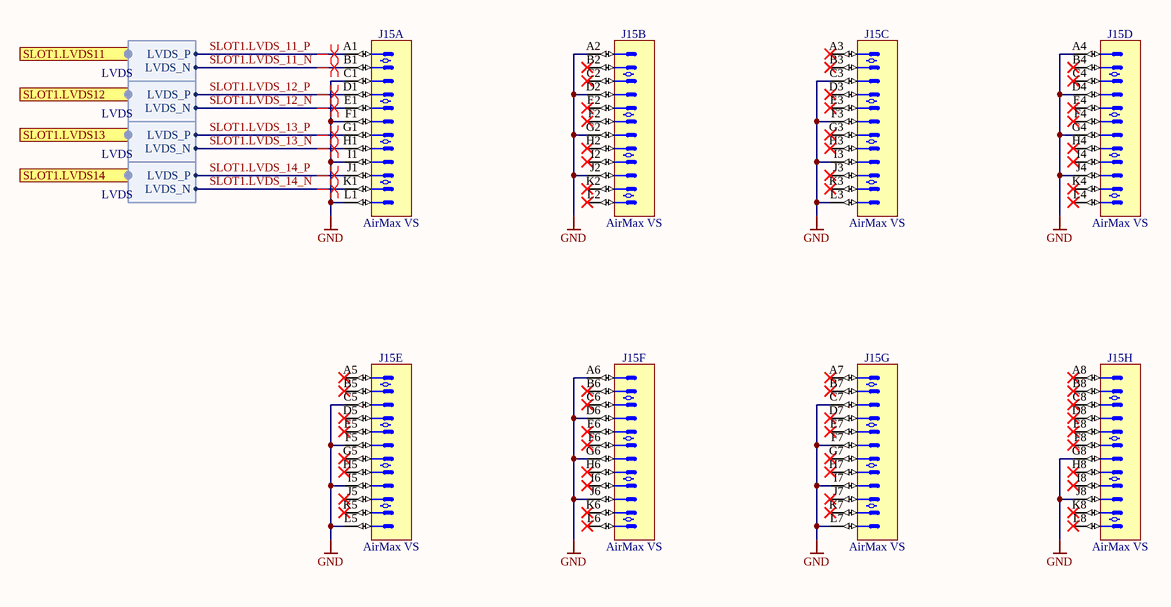
[diagram p5: P6.SchDoc]

### Parts
J15  AirMax VS  [AMPHENOL_10052838-101LF]  (parts A,B,C,D,E,F,G,H of 8)

### Ports
SLOT1.LVDS11 (harness LVDS), SLOT1.LVDS12 (harness LVDS), SLOT1.LVDS13 (harness LVDS), SLOT1.LVDS14 (harness LVDS)

### Harnesses
LVDS: LVDS_P, LVDS_N

### Nets
GND: J15.A2 J15.A4 J15.A6 J15.C1 J15.C3 J15.C5 J15.C7 J15.D2 J15.D4 J15.D6 J15.F1 J15.F3 J15.F5 J15.F7 J15.G2 J15.G4 J15.G6 J15.G8 J15.I1 J15.I3 J15.I5 J15.I7 J15.J2 J15.J4 J15.J6 J15.J8 J15.L1 J15.L3 J15.L5 J15.L7
SLOT1.LVDS_11_N: J15.B1 ; port SLOT1.LVDS11.LVDS_N  [project net LVDS1_N]
SLOT1.LVDS_11_P: J15.A1 ; port SLOT1.LVDS11.LVDS_P  [project net LVDS1_P]
SLOT1.LVDS_12_N: J15.E1 ; port SLOT1.LVDS12.LVDS_N  [project net LVDS2_N]
SLOT1.LVDS_12_P: J15.D1 ; port SLOT1.LVDS12.LVDS_P  [project net LVDS2_P]
SLOT1.LVDS_13_N: J15.H1 ; port SLOT1.LVDS13.LVDS_N  [project net LVDS3_N]
SLOT1.LVDS_13_P: J15.G1 ; port SLOT1.LVDS13.LVDS_P  [project net LVDS3_P]
SLOT1.LVDS_14_N: J15.K1 ; port SLOT1.LVDS14.LVDS_N  [project net LVDS4_N]
SLOT1.LVDS_14_P: J15.J1 ; port SLOT1.LVDS14.LVDS_P  [project net LVDS4_P]

Not connected (* = marked no-connect by the designer): J15 A3* A5* A7* A8* B2* B3* B4* B5* B6* B7* B8* C2* C4* C6* C8* D3* D5* D7* D8* E2* E3* E4* E5* E6* E7* E8* F2* F4* F6* F8* G3* G5* G7* H2* H3* H4* H5* H6* H7* H8* I2* I4* I6* I8* J3* J5* J7* K2* K3* K4* K5* K6* K7* K8* L2* L4* L6* L8*

### Layout directives
differential pair: LVDS1_N, LVDS1_P, LVDS2_N, LVDS2_P, LVDS3_N, LVDS3_P, LVDS4_N, LVDS4_P

### Notes on the sheet
- ARTIQ
- Project
- Name
- Sheet
- 2020
- Size
- A4
- of
- 1.0
- Rev
- Copyright WUT ISE 2020.
  This document describes Open Hardware and is licensed under the CERN-OHL-S v2
  You may redistribute and modify this documentation and make products using it under the terms of the CERN-OHL-S v2 (https:/cern.ch/cern-ohl). This documentation is distributed WITHOUT ANY EXPRESS OR IMPLIED WARRANTY, INCLUDING OF MERCHANTABILITY, SATISFACTORY QUALITY AND FITNESS FOR A PARTICULAR PURPOSE. Please see the CERN-OHL-S v2 for applicable conditions.
  As per CERN-OHL-S v2 section 4, should You produce hardware based on these sources, You must maintain the Source Location visible on the silkscreen or top copper for a DI/OT System Board PCB or other product you make using this documentation.
- -------------------------------

### Library data of the parts
J15 = AMPHENOL_10052838-101LF: 96 Contacts Header, 8 Columns, 4 Pairs per Column; Part Description: 96 Contacts, 2mm Pitch, 8 Columns, 4 Pairs per Column, 4 Walls, Right Angle Header; Part Number: AMPHENOL_10052838-101LF; Component Kind: Standard; Component Type: Standard; Pin Count: 96; Family: AirMax VS; Mounted: Yes; Socket: No; SMD: No; PressFit: Yes; Sense: No; Status: None; Manufacturer: AMPHENOL; Manufacturer Part Number: 10052838-101LF; ComponentHeight: 15.35mm; HelpURL: \\cern.ch\dfs\Applications\Altium\Datasheets\AMPHENOL_10052838-101LF.pdf; ComponentLink1URL: \\cern.ch\dfs\Applications\Altium\Datasheets\AMPHENOL_10052838-101LF_Application.pdf; ComponentLink1Description: Application; Author: CERN DEM MR; CreateDate: 19/02/2018; LatestRevisionDate: 19/02/2018

## Sheet Channel.SchDoc: DIO MCX 16 Isolated
size A4; DocumentNumber: 2; SheetNumber: 2; SheetTotal: 7; ModifiedBy: -; CreateDate: XX/XX/XXXX; CheckedDate: -; Title2: Title2
Used 8 times, as channels U_Channel1, U_Channel2, U_Channel3, U_Channel4, U_Channel5, U_Channel6, U_Channel7, U_Channel8. Parts and nets are listed once, with the designators drawn on the sheet.
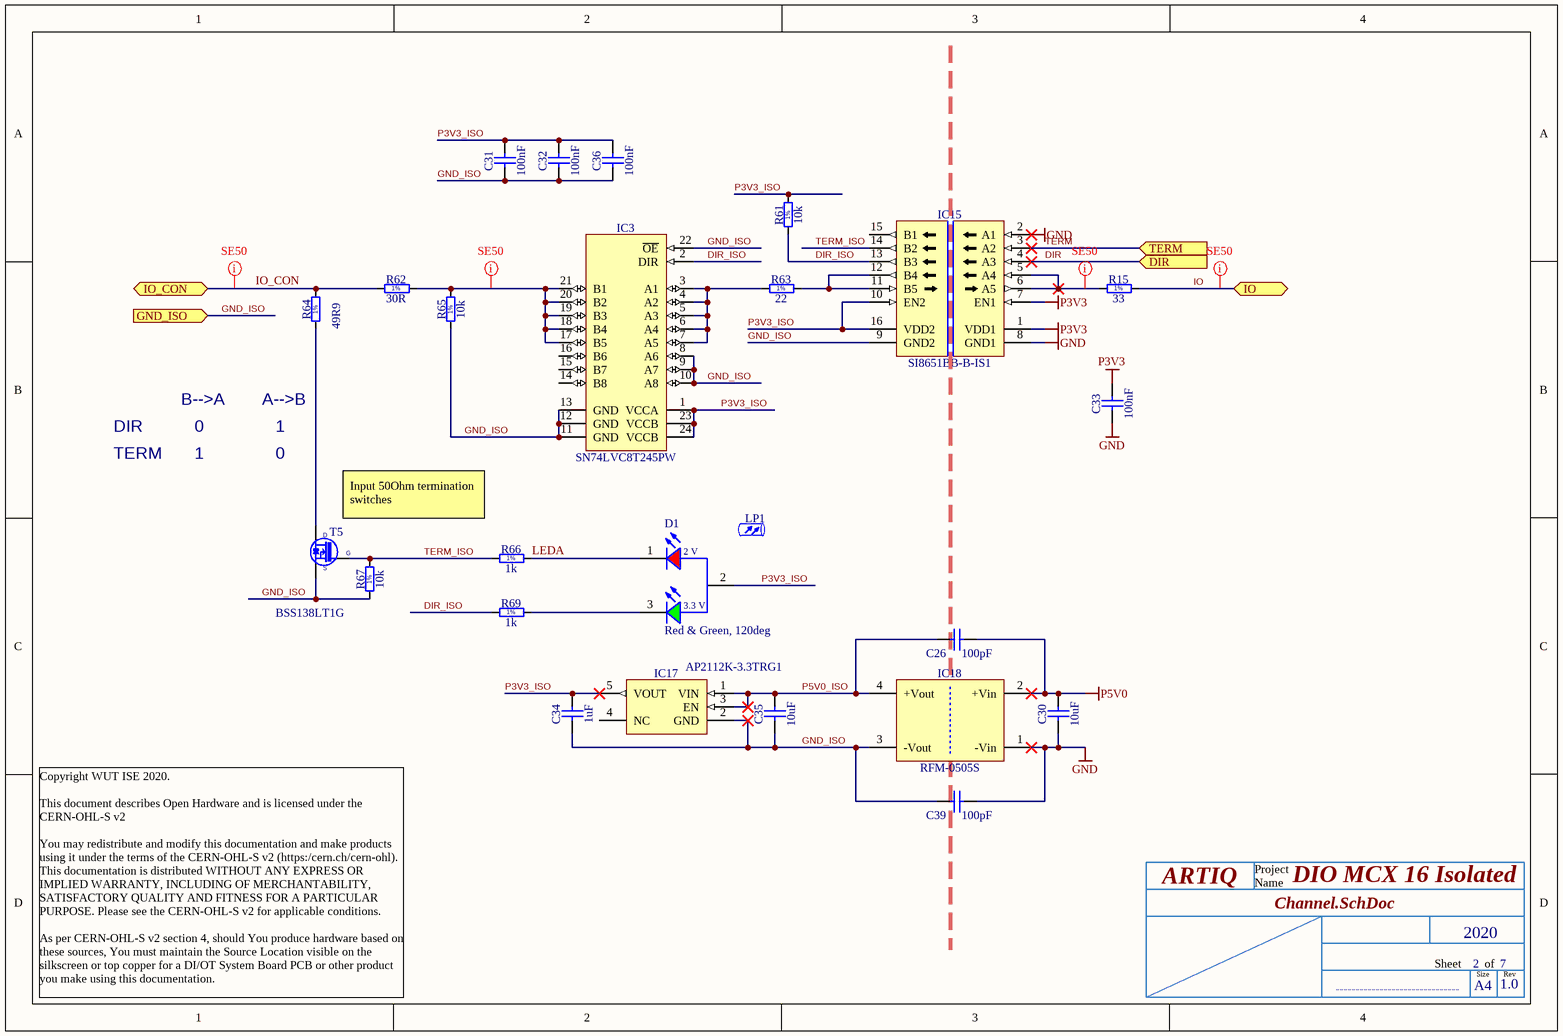
[diagram p6: Channel.SchDoc]

### Parts
C26  100pF  [CAPC3216X180N]
C30  10uF  [CAPC1608X80N]
C31  100nF  [CAPC1005X55N]
C32  100nF  [CAPC1005X55N]
C33  100nF  [CAPC1005X55N]
C34  1uF  [CAPC1005X55N]
C35  10uF  [CAPC1608X80N]
C36  100nF  [CAPC1005X55N]
C39  100pF  [CAPC3216X180N]
D1  Red & Green, 120deg  [WL-SBSW_1204]
IC3  SN74LVC8T245PW  [SOP65P640X120-24N]
IC15  SI8651BB-B-IS1  [SOIC127P600X175-16N]
IC17  AP2112K-3.3TRG1  [SOT95P285X140-5N]
IC18  RFM-0505S  [DCDC_RECOM_RFM]
LP1  (no value)  [FIX&FASTEN-LEMB2-8V0-F]  (no BOM)
R15  33  [RESC1005X40N]
R61  10k  [RESC1005X40N]
R62  30R  [RESC3225X70N]
R63  22  [RESC1005X40N]
R64  49R9  [RESC3225X70N]
R65  10k  [RESC1005X40N]
R66  1k  [RESC1005X40N]
R67  10k  [RESC1005X40N]
R69  1k  [RESC1005X40N]
T5  BSS138LT1G  [SOT95P240X110-3N]

### Ports
DIR (in), GND_ISO (in), IO (bidir), IO_CON (bidir), TERM (in)

### Nets
GND: C30.1 C33.1 C39.2 IC15.2(A1) IC15.8(GND1) IC18.1(-Vin)
P3V3: C33.2 IC15.1(VDD1) IC15.7(EN1)
P5V0: C26.2 C30.2 IC18.2(+Vin)
DIR: IC15.4(A3) ; port DIR
DIR_ISO: IC3.2(DIR) IC15.13(B3) R61.1 R69.1
GND_ISO: C31.1 C32.1 C34.1 C35.1 C36.1 C39.1 IC3.8(A6) IC3.9(A7) IC3.10(A8) IC3.11(GND) IC3.12(GND) IC3.13(GND) IC3.22(~{OE}) IC15.9(GND2) IC17.2(GND) IC18.3(-Vout) R65.1 R67.1 T5.2(S) ; port GND_ISO
IO: R15.2 ; port IO
IO_CON: R62.1 R64.2 ; port IO_CON
LEDA: D1.1(K) R66.2
P3V3_ISO: C31.2 C32.2 C34.2 C36.2 D1.2(A) IC3.1(VCCA) IC3.23(VCCB) IC3.24(VCCB) IC15.10(EN2) IC15.16(VDD2) IC17.5(VOUT) R61.2
P5V0_ISO: C26.1 C35.2 IC17.1(VIN) IC17.3(EN) IC18.4(+Vout)
TERM: IC15.3(A2) ; port TERM
TERM_ISO: IC15.14(B2) R66.1 R67.2 T5.1(G)
NetD1_3: D1.3(K) R69.2
NetIC3_3: IC3.3(A1) IC3.4(A2) IC3.5(A3) IC3.6(A4) IC3.7(A5) R63.1
NetIC3_17: IC3.17(B5) IC3.18(B4) IC3.19(B3) IC3.20(B2) IC3.21(B1) R62.2 R65.2
NetIC15_5: IC15.5(A4) IC15.6(A5) R15.1
NetIC15_11: IC15.11(B5) IC15.12(B4) R63.2
NetR64_1: R64.1 T5.3(D)

Not connected (* = marked no-connect by the designer): IC3 14(B8) 15(B7) 16(B6); IC15 15(B1); IC17 4(NC)

### Channels
U_Channel1: designators end in A; ports DIR=DIR GND_ISO=GND_ISO IO=IO IO_CON=IO_CON TERM=TERM
U_Channel2: designators end in B; ports DIR=DIR GND_ISO=GND_ISO IO=IO IO_CON=IO_CON TERM=TERM
U_Channel3: designators end in C; ports DIR=DIR GND_ISO=GND_ISO IO=IO IO_CON=IO_CON TERM=TERM
U_Channel4: designators end in D; ports DIR=DIR GND_ISO=GND_ISO IO=IO IO_CON=IO_CON TERM=TERM
U_Channel5: designators end in E; ports DIR=DIR GND_ISO=GND_ISO IO=IO IO_CON=IO_CON TERM=TERM
U_Channel6: designators end in F; ports DIR=DIR GND_ISO=GND_ISO IO=IO IO_CON=IO_CON TERM=TERM
U_Channel7: designators end in G; ports DIR=DIR GND_ISO=GND_ISO IO=IO IO_CON=IO_CON TERM=TERM
U_Channel8: designators end in H; ports DIR=DIR GND_ISO=GND_ISO IO=IO IO_CON=IO_CON TERM=TERM

### Layout directives
net class SE50; rule Width Constraint [Pref Width = 0.35mm    Min Width = 0.3mm    Max Width = 0.35mm]: IO, IO_CON, NetIC3A_17, NetIC15A_5

### Notes on the sheet
- DIR
- B-->A
- 0
- A-->B
- 1
- TERM
- (near T5) Input 50Ohm termination switches
- ARTIQ
- Project
- Name
- Sheet
- 2020
- Size
- A4
- of
- 1.0
- Rev
- Copyright WUT ISE 2020.
  This document describes Open Hardware and is licensed under the CERN-OHL-S v2
  You may redistribute and modify this documentation and make products using it under the terms of the CERN-OHL-S v2 (https:/cern.ch/cern-ohl). This documentation is distributed WITHOUT ANY EXPRESS OR IMPLIED WARRANTY, INCLUDING OF MERCHANTABILITY, SATISFACTORY QUALITY AND FITNESS FOR A PARTICULAR PURPOSE. Please see the CERN-OHL-S v2 for applicable conditions.
  As per CERN-OHL-S v2 section 4, should You produce hardware based on these sources, You must maintain the Source Location visible on the silkscreen or top copper for a DI/OT System Board PCB or other product you make using this documentation.
- -------------------------------
- (in symbol 155124RG73200) 2 V; 3.3 V
- (in symbol R0402_1K_1%_0.0625W_100PPM) 1%
- (in symbol R0402_10K_1%_0.0625W_100PPM) 1%
- (in symbol R0402_22R_1%_0.0625W_100PPM) 1%
- (in symbol R0402_33R_1%_0.0625W_100PPM) 1%
- (in symbol R1210_30R_5%_0.5W_200PPM) 1%
- (in symbol R1210_49R9_1%_0.5W_100PPM_VISHAY_CRCW) 1%

### Library data of the parts
C26 C39 = CC1206_100PF_2KV_5%_C0G: Non-polarised capacitor; Part Description: High Voltage MLC Chip Capacitor; Manufacturer: GENERIC; Manufacturer1 Part Number: 1206GA101JAT2A; Voltage: 2kV; TC: C0G/NP0; Tolerance: ±5%; Part Number: CC1206_100PF_2KV_5%_C0G; Component Kind: Standard; Component Type: Standard; Pin Count: 2; Value: 100pF; Status: None; Manufacturer Part Number: CC1206_100PF_2KV_5%_C0G; Case: 1206; Mounted: Yes; Socket: No; SMD: Yes; Sense: No; Manufacturer1 Example: AVX; Manufacturer1 ComponentHeight: 1.8mm; HelpURL: \\cern.ch\dfs\Applications\Altium\Datasheets\CC1206_C0G_AVX_HV-MLC.pdf; Author: CERN DEM JLC; CreateDate: 17.05.2017; LatestRevisionDate: 17.05.2017
C30 C35 = CC0603_10UF_16V_20%_X5R: Non-polarised capacitor; Part Description: SMD Multilayer Chip Ceramic Capacitor; Manufacturer: GENERIC; Manufacturer1 Part Number: GRM188R61C106MA73D; Voltage: 16V; TC: X5R; Tolerance: ±20%; Part Number: CC0603_10UF_16V_20%_X5R; Component Kind: Standard; Component Type: Standard; Pin Count: 2; Value: 10uF; Status: None; Manufacturer Part Number: CC0603_10UF_16V_20%_X5R; Case: 0603; Mounted: Yes; Socket: No; SMD: Yes; Sense: No; Manufacturer1 Example: MURATA; Manufacturer1 ComponentHeight: 0.8mm; HelpURL: \\cern.ch\dfs\Applications\Altium\Datasheets\CC0603_X5R_MURATA_GRM.pdf; Author: CERN DEM MR; CreateDate: 02.03.2016; LatestRevisionDate: 02.03.2016
C31-C33 C36 = CC0402_100NF_50V_10%_X7R: Non-polarised capacitor; Part Description: SMD Multilayer Chip Ceramic Capacitor; Manufacturer: GENERIC; Manufacturer1 Part Number: GRM155R71H104KE14D; Voltage: 50V; TC: X7R; Tolerance: ±10%; Part Number: CC0402_100NF_50V_10%_X7R; Component Kind: Standard; Component Type: Standard; Pin Count: 2; Value: 100nF; Status: None; Manufacturer Part Number: CC0402_100NF_50V_10%_X7R; Case: 0402; Mounted: Yes; Socket: No; SMD: Yes; Sense: No; Manufacturer1 Example: MURATA; Manufacturer1 ComponentHeight: 0.55mm; HelpURL: \\cern.ch\dfs\Applications\Altium\Datasheets\CC0402_MURATA_GRM155R71H104KE14D.pdf; Author: CERN DEM MR; CreateDate: 30.06.2017; LatestRevisionDate: 30.06.2017
C34 = CC0402_1UF_16V_10%_X5R: Non-polarised capacitor; Part Description: SMD Multilayer Chip Ceramic Capacitor; Manufacturer: GENERIC; Manufacturer1 Part Number: C1005X5R1C105KT; Voltage: 16V; TC: X5R; Tolerance: ±10%; Part Number: CC0402_1UF_16V_10%_X5R; Component Kind: Standard; Component Type: Standard; Pin Count: 2; Value: 1uF; Status: Preferred; Manufacturer Part Number: CC0402_1UF_16V_10%_X5R; Case: 0402; Mounted: Yes; Socket: No; SMD: Yes; Sense: No; Manufacturer1 Example: TDK; Manufacturer1 ComponentHeight: 0.55mm; HelpURL: \\cern.ch\dfs\Applications\Altium\Datasheets\CC0402_X5R_TDK_C.pdf; Author: CERN DEM JLC; CreateDate: 25.10.2012; LatestRevisionDate: 25.10.2012
D1 = 155124RG73200: WL-SBSW SMT Bi-color Side View Waterclear, size 1204, Red & Green, 120deg; Luminous Intensity: 160mcd@Green, 60mcd@Red; Dominant Wavelength: 525nm@Green, 624nm@Red; Forward Voltage: 3.3V@Green, 2V@Red; Peak Wavelength: 520nm@Green, 632nm@Red; Chip Technology: AlInGaP + InGaN; ComponentLink1Description: Manufacturer; ComponentLink1URL: http://www.we-online.de; ComponentLink2Description: Datasheet; ComponentLink2URL: https://katalog.we-online.de/led/datasheet/155124RG73200.pdf; Emitting Color: Red & Green; Operating Temperature: -40 to +85degC; Mounting Technology: SMT; Part Number: 155124RG73200; Packaging: Tape and Reel; Published Date: October 2019; Publisher: Wurth Elektronik; Size: 1204; Viewing Angle: 120deg
IC3 = SN74LVC8T245PW: 8-Bit Dual-Supply Bus Transceiver With Configurable Voltage Translation and 3-State Outputs; Manufacturer: TEXAS INSTRUMENTS; PressFit: No; Bonding: No; Part Number: SN74LVC8T245PW; Component Kind: Standard; Component Type: Standard; Device: SN74LVC8T245PW; PackageDescription: SOP, 0.65mm Pitch; 24 Pin, 4.40mm W X 7.80mm L X 1.20mm H Body, IPC Medium Density; Part Description: 8-Bit Dual-Supply Bus Transceiver With Configurable Voltage Translation and 3-State Outputs; Manufacturer Part Number: SN74LVC8T245PW; Pin Count: 24; Case: TSSOP24; Mounted: Yes; Socket: No; SMD: Yes; Sense: No; ComponentHeight: 1.2mm; Author: CERN DEM JLC; HelpURL: \\cern.ch\dfs\Applications\Altium\Datasheets\SN74LVC8T245PW.pdf; CreateDate: 02.09.2009; LatestRevisionDate: 02.09.2009
IC15 = SI8651BB-B-IS1: Low Power Five-Channel Digital Isolator; Part Description: 2.5kV 150Mbps Low Power Five-Channel Digital Isolator; Manufacturer: SILICON LABS; PressFit: No; Bonding: No; Part Number: SI8651BB-B-IS1; Component Kind: Standard; Component Type: Standard; Device: SI8651BB-B-IS1; PackageDescription: SOIC 16, Pitch 1.27mm - Body 4x10mm, IPC Medium Density; Manufacturer Part Number: SI8651BB-B-IS1; Pin Count: 16; Case: SOIC16; Mounted: Yes; Socket: No; SMD: Yes; Sense: No; ComponentHeight: 1.75mm; Author: CERN DEM JLC; HelpURL: \\cern.ch\dfs\Applications\Altium\Datasheets\SI8651BB-B-IS1.pdf; CreateDate: 31.10.2013; LatestRevisionDate: 31.10.2013
IC17 = AP2112K-3.3TRG1: 600mA CMOS Low Dropout Linear Regulator with Enable; Part Description: 3.3V 600mA CMOS Low Dropout Linear Regulator with Enable; Manufacturer: DIODES INCORPORATED; PressFit: No; Bonding: No; Part Number: AP2112K-3.3TRG1; Component Kind: Standard; Component Type: Standard; Device: AP2112K-3.3TRG1; PackageDescription: SOT23, 0.95mm Pitch; 5 Pin, 1.6mm W X 3.0mm L X 1.40mm H body, IPC Medium Density; Manufacturer Part Number: AP2112K-3.3TRG1; Pin Count: 5; Case: SOT25; Mounted: Yes; Socket: No; SMD: Yes; Sense: No; ComponentHeight: 1.4mm; HelpURL: \\cern.ch\dfs\Applications\Altium\Datasheets\AP2112K-3.3TRG1.pdf; Author: CERN DEM MR; CreateDate: 13.12.2017; LatestRevisionDate: 13.12.2017
IC18 = RFM-0505S: RECOM, RFM Serie, Single Output DCDC Converter; Part Description: 5V ±10% to 5V, Iout (max) 200mA, 1W DC-DC Converter; PressFit: No; Bonding: No; Part Number: RFM-0505S; Component Kind: Standard; Component Type: Standard; Device: RFM-0505S; PackageDescription: RFM Series, Body 11.5 x 6.00mm, SIP-4 Package; Manufacturer: RECOM; Manufacturer Part Number: RFM-0505S; Pin Count: 4; Mounted: Yes; Socket: No; SMD: No; Sense: No; ComponentHeight: 10.5mm; HelpURL: \\cern.ch\dfs\Applications\Altium\Datasheets\RFM-0505S.pdf; Author: CERN DEM BC; CreateDate: 16.07.2020; LatestRevisionDate: 16.07.2020
LP1 = LED Light_pipe_2.3x8mm: Part Description: Right Angle Single Element 2.3x8mm Round Lightpipe; Manufacturer: FIX&FASTEN; Manufacturer Part Number: FIX-LEMB2-8V0-F; PressFit: No; Bonding: No; Part Number: FIX&FASTEN-LEMB2-8V0-F; Component Type: Standard; PackageDescription: Right Angle Single Element 2.3mmx8mm Round Lightpipe; Pin Count: 0; Mounted: Yes; Socket: No; SMD: No; Sense: No; ComponentHeight: 2.3mm; HelpURL: \\cern.ch\dfs\Applications\Altium\Datasheets\LEDLP_DIALIGHT_515-1049F.pdf; Author: GK; CreateDate: 24.01.2017; LatestRevisionDate: 24.01.2017
R15 = R0402_33R_1%_0.0625W_100PPM: as R17 on sheet LVDS_IFC_MCX; Part Number: R0402_33R_1%_0.0625W_100PPM; Component Kind: Standard; Component Type: Standard; Pin Count: 2; Value: 33; Status: Not Recommended; Power: 0.0625W; Tolerance: ±1%; Manufacturer Part Number: R0402_33R_1%_0.0625W_100PPM; Case: 0402; Mounted: Yes; Sense: No; Socket: No; SMD: Yes; Manufacturer1 Example: YAGEO PHYCOMP; Manufacturer1 ComponentHeight: 0.4mm; HelpURL: \\cern.ch\dfs\Applications\Altium\Datasheets\R0402_Phycomp_RC0402.pdf; Author: CERN DEM JLC; CreateDate: 03.12.2007; LatestRevisionDate: 17.10.2012
R61 R67 = R0402_10K_1%_0.0625W_100PPM: Resistor - 1%; Part Description: General Purpose Thick Film Chip Resistor; Manufacturer: GENERIC; Manufacturer1 Part Number: 232270671003L; TC: ±100ppm/°C; PressFit: No; Part Number: R0402_10K_1%_0.0625W_100PPM; Component Kind: Standard; Component Type: Standard; Pin Count: 2; Value: 10k; Status: Not Recommended; Power: 0.0625W; Tolerance: ±1%; Manufacturer Part Number: R0402_10K_1%_0.0625W_100PPM; Case: 0402; Mounted: Yes; Sense: No; Socket: No; SMD: Yes; Manufacturer1 Example: YAGEO PHYCOMP; Manufacturer1 ComponentHeight: 0.4mm; HelpURL: \\cern.ch\dfs\Applications\Altium\Datasheets\R0402_Phycomp_RC0402.pdf; Author: CERN DEM JLC; CreateDate: 03.12.2007; LatestRevisionDate: 17.10.2012
R62 = R1210_30R_5%_0.5W_200PPM: Resistor - 5%; Part Description: Thick Film Chip Resistor; Manufacturer: VISHAY; Manufacturer Part Number: CRCW121030R0JNEA; Power: 0.5W; TC: ±200ppm/°C; PressFit: No; Part Number: R1210_30R_5%_0.5W_200ppm; Component Kind: Standard; Component Type: Standard; Pin Count: 2; Value: 30R; Status: None; Tolerance: ±5%; Case: 1210; Mounted: Yes; Sense: No; Socket: No; SMD: Yes; HelpURL: \\cern.ch\dfs\Applications\Altium\Datasheets\R1210_VISHAY_CRCW1210.pdf; Author: CERN DEM JMW; CreateDate: 06.08.2014; LatestRevisionDate: 06.08.2014; ComponentHeight: 0.6mm
R63 = R0402_22R_1%_0.0625W_100PPM: as R28 on sheet P1; Part Number: R0402_22R_1%_0.0625W_100PPM; Component Kind: Standard; Component Type: Standard; Pin Count: 2; Value: 22; Status: Not Recommended; Power: 0.0625W; Tolerance: ±1%; Manufacturer Part Number: R0402_22R_1%_0.0625W_100PPM; Case: 0402; Mounted: Yes; Sense: No; Socket: No; SMD: Yes; Manufacturer1 Example: YAGEO PHYCOMP; Manufacturer1 ComponentHeight: 0.4mm; HelpURL: \\cern.ch\dfs\Applications\Altium\Datasheets\R0402_Phycomp_RC0402.pdf; Author: CERN DEM JLC; CreateDate: 03.12.2007; LatestRevisionDate: 17.10.2012
R64 = R1210_49R9_1%_0.5W_100PPM_VISHAY_CRCW: Resistor - 1%; Part Description: Thick Film Chip Resistor; Manufacturer: VISHAY DRALORIC; Manufacturer Part Number: CRCW121049R9FKTA; Power: 0.5W; TC: ±100ppm/°C; Part Number: R1210_49R9_1%_0.5W_100PPM_VISHAY_CRCW; Component Kind: Standard; Component Type: Standard; Pin Count: 2; Value: 49R9; Status: None; Tolerance: ±1%; Case: 1210; Mounted: Yes; Sense: No; Socket: No; SMD: Yes; ComponentHeight: 0.6mm; HelpURL: \\cern.ch\dfs\Applications\Altium\Datasheets\R1210_VISHAY_CRCW1210.pdf; Author: CERN DEM JMW; CreateDate: 06.08.2014; LatestRevisionDate: 06.08.2014
R65 = R0402_10K_1%_0.0625W_100PPM: as R30 on sheet DIO_MCX_Isolated; Part Number: R0402_10K_1%_0.0625W_100PPM; Component Kind: Standard; Component Type: Standard; Pin Count: 2; Value: 10k; Status: Not recommended; Power: 0.0625W; Tolerance: ±1%; Manufacturer Part Number: R0402_10K_1%_0.0625W_100PPM; Case: 0402; Mounted: Yes; Sense: No; Socket: No; SMD: Yes; Manufacturer1 Example: YAGEO PHYCOMP; Manufacturer1 ComponentHeight: 0.4mm; HelpURL: \\cern.ch\dfs\Applications\Altium\Datasheets\R0402_Phycomp_RC0402.pdf; Author: CERN DEM JLC; CreateDate: 03.12.2007; LatestRevisionDate: 17.10.2012
R66 R69 = R0402_1K_1%_0.0625W_100PPM: Resistor - 1%; Part Description: General Purpose Thick Film Chip Resistor; Manufacturer: GENERIC; Manufacturer1 Part Number: 232270671002L; TC: ±100ppm/°C; PressFit: No; Part Number: R0402_1K_1%_0.0625W_100PPM; Component Kind: Standard; Component Type: Standard; Pin Count: 2; Value: 1k; Status: Not Recommended; Power: 0.0625W; Tolerance: ±1%; Manufacturer Part Number: R0402_1K_1%_0.0625W_100PPM; Case: 0402; Mounted: Yes; Sense: No; Socket: No; SMD: Yes; Manufacturer1 Example: YAGEO PHYCOMP; Manufacturer1 ComponentHeight: 0.4mm; HelpURL: \\cern.ch\dfs\Applications\Altium\Datasheets\R0402_Phycomp_RC0402.pdf; Author: CERN DEM JLC; CreateDate: 03.12.2007; LatestRevisionDate: 17.10.2012
T5 = BSS138LT1G: N-CHANNEL MOSFET WITH DIODE; Part Description: 50V 200mA N-Channel Enhancement Mode Field-Effect Transistor; Manufacturer: ON SEMICONDUCTOR; PressFit: No; Bonding: No; Part Number: BSS138LT1G; Component Kind: Standard; Component Type: Standard; Device: BSS138LT1G; PackageDescription: SOT23 3-Leads, Pitch 0.95mm - Body 1.4x3mm, IPC Medium Density; Manufacturer Part Number: BSS138LT1G; Pin Count: 3; Case: SOT23-3; Mounted: Yes; Socket: No; SMD: Yes; Sense: No; ComponentHeight: 1.11mm; HelpURL: \\cern.ch\dfs\Applications\Altium\Datasheets\BSS138LT1G.pdf; Author: CERN DEM JLC; CreateDate: 23.03.2009; LatestRevisionDate: 23.03.2009